# EasyEDA Pro project sincon_badge.eprj, board 1-PCB_PCB_Yuzuki2040
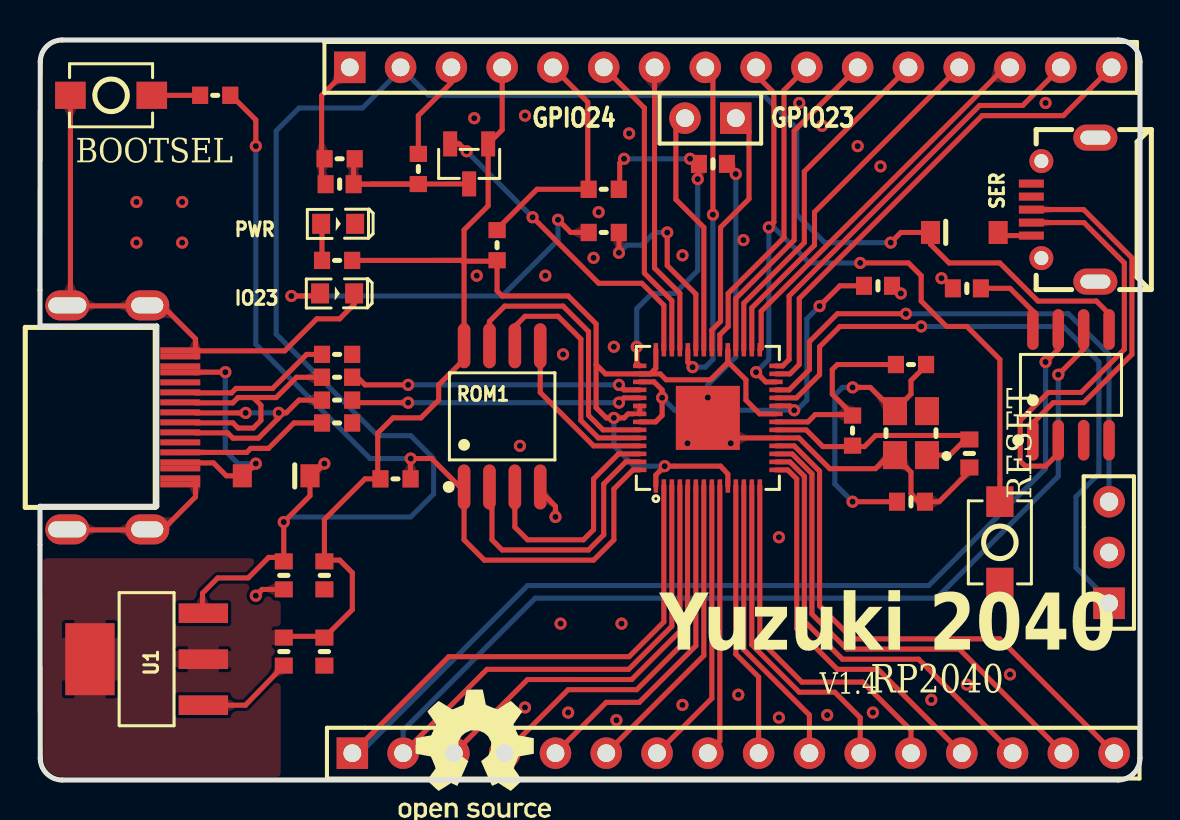
[diagram p2: board, top side]
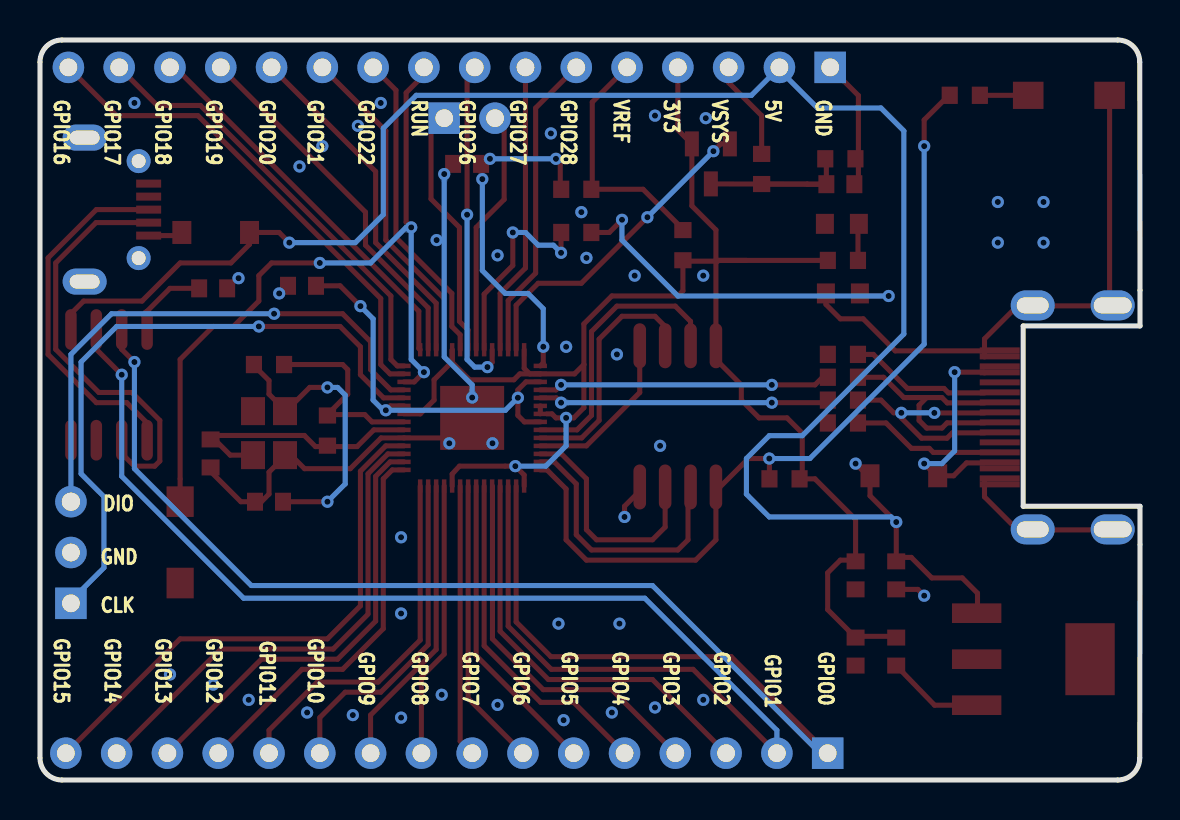
[diagram p3: board, bottom side, seen from below]

Outline 55.01 x 37 mm; copper layers: Top Layer, Bottom Layer. Coordinates in mm from the lower left corner of the outline.
Outline path: 0,24.48 0.01,35.9 arc(0.34,36.68) 1.11,37 53.91,37 arc(54.69,36.68) 55.01,35.9 55.01,1.1 arc(54.69,0.32) 53.91,0 1.11,0 arc(0.34,0.32) 0.01,1.1 0,11.76

## Design rules (mm)
via Default (default): diameter min 0.457, default 0.457, max 100.025; hole min 0.203, default 0.203, max 59.995
pour e88 uses gge9161
pour e585 uses gge15034
pour e587 uses gge15036

## Placement (name value [footprint] x y rotation side)
BOOTSEL  TSA343G00-250J2  [SW-SMD_L4.0-W2.9-LS5.0]  3.56 34.23 0 top
C1  0.1uf  [C0603 NSK]  12.19 6.42 270 top
C2  0.1uf  [C0603 NSK]  12.19 10.23 270 top
C3  0.1u  [C0603 NSK]  33.66 30.81 180 top
C4  0.1u  [C0603 NSK]  14.22 10.23 90 top
C5  2.2u  [C0603 NSK]  14.22 6.42 90 top
C6  1n  [C0603 NSK]  14.99 29.79 0 top
C7  15p  [C0603 NSK]  46.48 16.33 90 top
C8  15p  [C0603 NSK]  43.56 13.91 180 top
C9  0.1u  [C0603 NSK]  41.91 24.71 0 top
C10  10n  [C0603 NSK]  46.36 24.58 180 top
D1  1N4007W  [SOD-123 NSK]  11.81 15.21 180 top
D2  1N4007W  [SOD-123 NSK]  46.23 27.38 0 top
H1  HDR-F-2.54_1x3  [HDR-F-2.54_1X3]  53.47 11.37 90 top
H2  HDR-F-2.54_1x16  [HDR-F-2.54_1X16]  34.67 1.34 0 top
H3  HDR-F-2.54_1x16  [HDR-F-2.54_1X16]  34.54 35.63 0 top
H4  HDR-F-2.54_1x2  [HDR-F-2.54_1X2]  33.53 33.09 180 top
IO23  LED-0603_G  [LED0603_GREEN]  14.86 24.33 0 top
PWR  LED-0603_G  [LED0603_GREEN]  14.91 27.81 0 top
Q2  AO3404  [SOT-23-3_L2.9-W1.3-P1.90-LS2.4-BR]  21.46 30.81 90 top
R1  27  [R0603 NSK]  14.86 18.99 180 top
R2  27  [R0603 NSK]  14.86 20.14 180 top
R3  1K  [R0603 NSK]  14.86 25.98 180 top
R4  DNF（不装）  [R0603 NSK]  17.78 15.06 180 top
R5  1k  [R0603 NSK]  8.76 34.23 0 top
R6  1R  [R0603 NSK]  28.19 29.54 180 top
R7  200R  [R0603 NSK]  22.86 26.74 270 top
R8  470  [R0603 NSK]  28.19 27.38 180 top
R9  200k  [R0603 NSK]  18.92 30.55 90 top
R10  DNF  [R0603 NSK]  40.64 17.47 90 top
R11  100k  [R0603 NSK]  14.99 31.06 0 top
R12  1k  [R0603 NSK]  43.56 20.77 180 top
R13  1k  [R0603 NSK]  14.86 21.28 180 top
R14  1k  [R0603 NSK]  14.86 17.85 180 top
RESET  TSA343G00-250J2  [SW-SMD_L4.0-W2.9-LS5.0]  48.01 11.88 270 top
ROM1  W25Q16JVSSIQ  [SOIC-8_L5.3-W5.3-P1.27-LS8.0-BL]  23.11 18.18 0 top
SER  MICROUSB FEMALE  [MICRO-USB-SMD_5P-P0.65-H-F_C10418]  51.18 28.52 90 top
U1  AMS1117-3.3V  [SOT-223-4_L6.5-W3.5-P2.30-LS7.0-BR]  5.33 6.04 0 top
U2  RP2040  [QFN-56_L7.0-W7.0-P0.90-TL-EP3.2]  33.4 18.11 90 top
U3  CH340N  [SOP-8_L5.0-W4.0-P1.27-LS6.0-BL]  51.56 19.76 0 top
USB1  TYPE-C  [USB-C-SMD_TYC-302-16]  4.19 18.13 270 top
X1  12MHz  [OSC-SMD_4P-L3.2-W2.5-BL-1]  43.56 17.34 90 top

## Footprints (pads in the part's own frame, mm; a bottom-side part is the same pattern mirrored in y, then rotated)
C0603 NSK
  rect 0.8x0.9 smd: 1(-0.7,0) 2(0.7,0)
HDR-F-2.54_1X2
  rect 1.575x1.575 hole 0.889: 1(-1.27,0)
  round 1.575 hole 0.889: 2(1.27,0)
HDR-F-2.54_1X3
  rect 1.575x1.575 hole 0.889: 1(-2.54,0)
  round 1.575 hole 0.889: 2(0,0)
  round 1.575 hole 0.914: 3(2.54,0)
HDR-F-2.54_1X16
  rect 1.575x1.575 hole 0.889: 1(-19.05,0)
  round 1.575 hole 0.889: 2(-16.51,0) 3(-13.97,0) 4(-11.43,0) 5(-8.89,0) 6(-6.35,0) 7(-3.81,0) 8(-1.27,0) 9(1.27,0) 10(3.81,0) 11(6.35,0) 12(8.89,0) 13(11.43,0) 14(13.97,0) 15(16.51,0) 16(19.05,0)
LED0603_GREEN
  rect 0.9x1 smd: 1(-0.85,0) 2(0.85,0)
MICRO-USB-SMD_5P-P0.65-H-F_C10418
  oval 1.3x2.2 hole 0.7x1.5: 0(-3.6,-1.6) 0(3.6,-1.6)
  round 1.2 hole 0.7: 0(-2.425,1.1) 0(2.425,1.1)
  rect 0.4x1.25 smd: 1(-1.3,1.6) 2(-0.65,1.6) 3(0,1.6) 4(0.65,1.6) 5(1.3,1.6)
OSC-SMD_4P-L3.2-W2.5-BL-1
  rect 1.4x1.2 smd: 1(-1.1,-0.8) 2(1.1,-0.8) 3(1.1,0.8) 4(-1.1,0.8)
QFN-56_L7.0-W7.0-P0.90-TL-EP3.2
  rect 0.665x0.224 smd: 1(-3.408,2.6) 2(-3.408,2.2) 3(-3.408,1.8) 4(-3.408,1.4) 5(-3.408,1) 6(-3.408,0.6) 7(-3.408,0.2) 8(-3.408,-0.2) 9(-3.408,-0.6) 10(-3.408,-1) 11(-3.408,-1.4) 12(-3.408,-1.8) 13(-3.408,-2.2) 14(-3.408,-2.6) 29(3.408,-2.6) 30(3.408,-2.2) 31(3.408,-1.8) 32(3.408,-1.4) 33(3.408,-1) 34(3.408,-0.6) 35(3.408,-0.2) 36(3.408,0.2) 37(3.408,0.6) 38(3.408,1) 39(3.408,1.4) 40(3.408,1.8) 41(3.408,2.2) 42(3.408,2.6)
  rect 0.224x0.665 smd: 15(-2.6,-3.408) 16(-2.2,-3.408) 17(-1.8,-3.408) 18(-1.4,-3.408) 19(-1,-3.408) 20(-0.6,-3.408) 21(-0.2,-3.408) 22(0.2,-3.408) 23(0.6,-3.408) 24(1,-3.408) 25(1.4,-3.408) 26(1.8,-3.408) 27(2.2,-3.408) 28(2.6,-3.408) 43(2.6,3.408) 44(2.2,3.408) 45(1.8,3.408) 46(1.4,3.408) 47(1,3.408) 48(0.6,3.408) 49(0.2,3.408) 50(-0.2,3.408) 51(-0.6,3.408) 52(-1,3.408) 53(-1.4,3.408) 54(-1.8,3.408) 55(-2.2,3.408) 56(-2.6,3.408)
  rect 3.2x3.2 smd: 57(0,0)
R0603 NSK
  rect 0.806x0.864 smd: 1(-0.753,0) 2(0.753,0)
SOD-123 NSK
  rect 0.95x1.15 smd: 1(-1.692,0) 2(1.692,0)
SOIC-8_L5.3-W5.3-P1.27-LS8.0-BL
  oval 0.63x2.25 smd: 1(-1.905,-3.53) 2(-0.635,-3.53) 3(0.635,-3.53) 4(1.905,-3.53) 5(1.905,3.53) 6(0.635,3.53) 7(-0.635,3.53) 8(-1.905,3.53)
SOP-8_L5.0-W4.0-P1.27-LS6.0-BL
  oval 0.574x2.035 smd: 1(-1.905,-2.768) 2(-0.635,-2.768) 3(0.635,-2.768) 4(1.905,-2.768) 5(1.905,2.768) 6(0.635,2.768) 7(-0.635,2.768) 8(-1.905,2.768)
SOT-23-3_L2.9-W1.3-P1.90-LS2.4-BR
  rect 1.25x0.7 smd: 1(1,-0.95) 2(1,0.95) 3(-1,0)
SOT-223-4_L6.5-W3.5-P2.30-LS7.0-BR
  rect 2.47x0.98 smd: 1(2.835,-2.3) 2(2.835,0) 3(2.835,2.3)
  rect 2.47x3.6 smd: 4(-2.835,0)
SW-SMD_L4.0-W2.9-LS5.0
  rect 1.53x1.36 smd: 1(-2.035,0) 2(2.035,0)
USB-C-SMD_TYC-302-16
  oval 1.5x2.2 hole 0.8x1.6: 1(-5.6,1.175) 2(5.6,1.175)
  oval 1.5x2.2 hole 0.8x1.9: 3(-5.6,-2.825) 4(5.6,-2.825)
  rect 0.3x2 smd: A1(-3.35,2.825) A4(-2.55,2.825) A5(-1.25,2.825) A6(-0.25,2.825) A7(0.25,2.825) A8(-1.75,2.825) A9(2.55,2.825) A12(3.35,2.825) B1(3.05,2.825) B4(2.25,2.825) B5(1.75,2.825) B6(0.75,2.825) B7(-0.75,2.825) B8(1.25,2.825) B9(-2.25,2.825) B12(-3.05,2.825)

## Nets
As in the schematic, except:
GND: BOOTSEL.1 C1.2 C2.2 C3.1 C4.1 C5.1 C6.1 C7.1 C8.1 C9.2 C10.2 H1.2 H3.1 IO23.2 PWR.2 R11.1 R13.1 R14.1 RESET.2 ROM1.4 SER.0 SER.5 U1.1 U2.19 U2.57 U3.3 USB1.1 USB1.2 USB1.3 USB1.4 USB1.A1 USB1.A12 USB1.B1 USB1.B12 X1.2 X1.4
D2_2: D2.2 SER.1
SD+: SER.3 U3.1
SD-: SER.2 U3.2

Pads without a net: SER 4; U3 4; USB1 A8 B8

## Via types
v1: diameter 0.61, hole 0.305, Top Layer to Bottom Layer, 84 vias

## Routing (per net, layer and track width the routed paths; a pad name or vN(x,y) marks a point on that pad's centre or on a via; arc(x,y) is an arc through that point)
1V1: length 19.9
  Top Layer w0.254: 41.01,24.71 40,24.71 v1(38.99,23.69) ; U2.50 30.79,17.91 31.12,18.23 31.12,19.5 30.71,19.91 U2.45 ; 37.72,18.49 37.5,18.71 36.81,18.71
  Bottom Layer w0.254: 31.11,19.11 31.74,18.49 37.85,18.49 38.35,18.99 38.35,23.06 v1(38.99,23.69)
  vias: v1(31.11,19.11) v1(37.72,18.49)
3V3: length 83.7
  Top Layer w0.254: 36.81,18.31 35.99,18.31 35.31,18.99 35.31,20.01 34.4,20.91 34.4,21.51 34.4,20.88 33.53,20.01 31.32,20.01 31.02,20.31 U2.44 ; 29.66,18.31 29.41,18.31 29.21,18.11 v1(28.7,18.11) 28.32,18.11 27.81,18.61 27.81,20.77 ; U2.44 30.52,20.31 30.8,20.58 30.8,21.51 ; U2.44 28.28,20.31 27.81,20.77 ; 19.69,25.98 21.08,25.98 21.12,25.94 22.86,25.94 22.86,24.46 23.11,24.2 26.42,24.2 27.81,22.8 27.81,20.77 ; 19.69,25.98 21.21,25.98 ; 19.69,25.98 15.66,25.98 ; U2.1 30.8,15.25 v1(31.24,15.69) 34.04,15.69 34.4,15.3 U2.10 ; C5.2 15.62,8.52 15.62,10.36 14.99,10.99 14.22,10.99 14.22,13.03 16.26,15.06 17.03,15.06 16.89,15.19 16.89,17.34 17.65,18.11 19.05,18.11 19.94,18.99 19.94,19.76 21.21,21.03 21.21,25.98 ; 21.21,25.98 21.21,27.5 22.41,28.71 Q2.1 23.11,32.51 H3.4 ; 2.54,6.04 U1.4 ; U2.48 U2.49 ; 12.19,7.18 14.22,7.18
  Bottom Layer w0.254: v1(31.24,15.69) 29.72,15.69 28.7,16.71 v1(28.7,18.11)
GND: length 77
  Top Layer w0.254: 36.81,17.1 37.96,17.1 39.5,15.57 41.78,15.57 42.46,16.24 42.71,16.24 43.56,15.39 43.56,14.3 43.94,13.91 44.97,13.91 46.48,15.43 ; C1.2 10.27,3.74 U1.1 ; 34.36,30.81 34.8,30.36 v1(34.8,30.3) ; 2.13,12.51 6.13,12.51 7.78,14.16 7.78,15.06 ; BOOTSEL.1 1.52,23.71 6.13,23.71 7.78,22.06 7.78,21.16 ; 7.78,21.46 12.24,21.46 13.84,23.06 14.99,23.06 15.71,23.78 15.71,24.2 ; v1(34.54,16.84) 34.81,17.1 U2.19 ; 10.8,9.22 11.11,9.53 12.19,9.53 ; 14.08,29.79 14.08,34.22 H3.1 ; 25.02,14.45 25.78,13.69 25.78,13.15
  Bottom Layer w0.254: v1(34.8,30.3) 34.8,21.15 33.4,19.76 v1(33.4,19.12)
  vias: v1(4.83,28.9) v1(4.83,26.87) v1(7.11,28.9) v1(7.11,26.87) v1(10.79,9.22) v1(21.72,33.09) v1(21.84,25.22) v1(21.84,4.01) v1(24,16.71) v1(24.26,33.22) v1(24.26,3.63) v1(25.27,25.22) v1(25.78,13.15) v1(26.03,7.82) v1(26.16,21.28) v1(26.42,3.37) v1(27.69,26.11) v1(27.94,28.39) v1(28.7,21.66) v1(28.83,2.99) v1(29.08,7.82) v1(29.46,32.33) v1(32.13,26.23) v1(32.13,3.75) v1(32.39,16.84) v1(34.92,4.26) v1(35.18,27) v1(36.96,12.14) v1(36.96,8.33) v1(36.96,3.12) v1(37.97,33.85) v1(39.12,32.71) v1(39.37,3.25) v1(40.89,31.69) v1(41.66,3.37) v1(42.04,30.68) v1(43.05,24.33) v1(44.58,4.01) v1(45.09,25.09) v1(46.35,4.77) v1(48.51,5.28) v1(50.29,33.85)
VBUS: length 94.1
  Top Layer w0.254: U3.5 53.47,23.31 52.83,23.95 49.91,23.95 48.01,25.85 45.47,25.85 44.54,26.78 44.54,27.38 43.05,27.38 v1(42.55,26.87) ; U1.3 8.13,8.38 8.13,9.34 8.89,10.1 10.41,10.1 11.44,11.13 12.19,11.13 12.19,12.9 13.5,14.21 D1.1 13.61,15.21 v1(14.22,15.82)
  Bottom Layer w0.254: v1(42.55,26.87) 39.24,26.87 37.85,28.27 37.85,32.58 36.19,34.23 19.43,34.23 H3.2 18.03,35.5 16.13,33.6 12.95,33.6 11.81,32.46 11.81,22.3 16.89,17.22 18.54,17.22 19.69,16.07 19.69,14.3 18.54,13.15 12.45,13.15 12.19,12.9
  vias: v1(12.19,12.9)
ADC_AVDD: length 17.6
  Top Layer w0.254: 28.99,29.54 28.99,30.84 v1(29.21,31.06) ; v1(32.89,30.04) 32.95,30.1 32.95,30.81 32.77,30.81 v1(32.51,31.06) ; 29.99,20.7 29.84,20.85 v1(29.84,21.66)
  Bottom Layer w0.254: v1(32.89,30.04) 32.89,25.47 31.75,24.33 30.61,24.33 29.84,23.57 v1(29.84,21.66) ; v1(32.51,31.06) v1(29.21,31.06)
ADC_VREF: length 12.2
  Top Layer w0.254: 22.86,27.54 24.85,29.54 27.39,29.54 27.39,33.89 H3.5
BOOTSEL_2: length 2.4
  Top Layer w0.254: 7.96,34.23 BOOTSEL.2
CC1: length 7.1
  Top Layer w0.254: R13.2 13.34,21.28 11.63,19.58 9.8,19.58 9.58,19.36 7.78,19.36
CC2: length 7.7
  Top Layer w0.254: USB1.B5 10.34,16.38 10.54,16.58 11.43,16.58 12.7,17.85 R14.2
D2_2: length 1.7
  Top Layer w0.254: 47.92,27.38 48.08,27.22 SER.1
GPIO0: length 72.9
  Top Layer w0.254: H2.1 20.45,6.17 29.46,6.17 31.2,7.91 U2.2 ; v1(50.29,20.9) 50.93,21.53 U3.7
  Bottom Layer w0.254: v1(50.29,20.9) 50.29,15.57 44.44,9.72 24.38,9.72 16,1.34 H2.1
GPIO1: length 70
  Top Layer w0.254: v1(50.93,20.26) 52.2,21.53 U3.6 ; U2.3 31.6,7.69 29.44,5.53 22.35,5.53 H2.2
  Bottom Layer w0.254: 18.16,1.47 18.16,2.48 24.77,9.09 44.83,9.09 50.93,15.18 v1(50.93,20.26)
GPIO2: length 21.1
  Top Layer w0.254: 32,14.7 32,7.44 29.59,5.02 24.38,5.02 H2.3
GPIO3: length 19.2
  Top Layer w0.254: 32.39,14.7 32.39,7.06 29.84,4.52 26.42,4.52 H2.4
GPIO4: length 17.2
  Top Layer w0.254: H2.5 28.32,3.88 29.97,3.88 32.8,6.71 U2.6
GPIO5: length 15.4
  Top Layer w0.254: U2.7 33.2,6.22 H2.6
GPIO6: length 14.5
  Top Layer w0.254: U2.8 33.6,4.08 H2.7
GPIO7: length 13.6
  Top Layer w0.254: H2.8 34,1.94 U2.9
GPIO8: length 13.8
  Top Layer w0.254: U2.11 34.8,6.29 35.94,5.15 H2.9
GPIO9: length 14.7
  Top Layer w0.254: 35.2,14.7 35.2,6.53 38.48,3.25 H2.10
GPIO10: length 16.6
  Top Layer w0.254: U2.13 35.6,6.76 37.97,4.39 39.75,4.39 41.02,3.12 H2.11
GPIO11: length 18.3
  Top Layer w0.254: 36,14.7 36,7 38.1,4.9 41.15,4.9 43.56,2.48 H2.12
GPIO12: length 19.5
  Top Layer w0.254: 36.81,15.5 37.4,15.5 37.85,15.06 37.85,7.56 39.88,5.53 41.91,5.53 H2.13
GPIO13: length 22.1
  Top Layer w0.254: H2.14 43.94,6.04 40.13,6.04 38.23,7.95 38.23,15.18 37.51,15.91 36.81,15.91
GPIO14: length 24.6
  Top Layer w0.254: U2.17 37.62,16.3 38.61,15.31 38.61,8.33 ; H2.15 45.97,6.55 40.35,6.55 38.61,8.29
GPIO15: length 27.2
  Top Layer w0.254: H2.16 48.01,7.06 40.64,7.06 38.99,8.71 38.99,15.44 37.72,16.71 36.81,16.71
GPIO16: length 25.1
  Top Layer w0.254: H3.16 51.18,33.22 47.12,33.22 37.97,24.07 37.97,20.77 37.51,20.31 36.81,20.31
GPIO17: length 22.3
  Top Layer w0.254: H3.15 49.15,33.73 46.99,33.73 37.47,24.2 37.47,21.03 37.14,20.7 36.81,20.7
GPIO18: length 19.5
  Top Layer w0.254: 36,21.51 36.07,21.58 36.07,23.44 48.26,35.63 H3.14
GPIO19: length 18.4
  Top Layer w0.254: 35.6,21.51 35.6,23.61 38.74,26.74 38.74,28.39 H3.13
GPIO20: length 17.5
  Top Layer w0.254: 35.2,21.51 35.2,23.84 38.23,26.87 38.23,30.42 H3.12
GPIO21: length 16.6
  Top Layer w0.254: H3.11 37.72,32.46 37.72,27 34.8,24.08 34.8,21.51
GPIO22: length 15.9
  Top Layer w0.254: H3.10 37.21,34.49 37.21,27.12 34.42,24.33 34.42,22.68 34,22.26 34,21.51
GPIO23: length 12.6
  Top Layer w0.254: U2.35 33.6,22.5 34.04,22.93 34.04,27.63 35.46,29.05 35.46,32.43 34.8,33.09
GPIO24: length 12.3
  Top Layer w0.254: H4.2 31.8,32.63 31.8,29.03 33.2,27.63 U2.36
GPIO25: length 10.3
  Top Layer w0.254: 28.99,27.38 28.96,27.34 28.96,26.36 ; 31.37,27.38 31.37,25.73 32.8,24.29 U2.37
  Bottom Layer w0.254: v1(28.96,26.36) 29.34,26.74 30.1,26.74 30.73,27.38 v1(31.37,27.38)
GPIO26_ADC0: length 16.9
  Top Layer w0.254: 32.64,20.65 32.4,20.88 32.4,21.51 ; H3.8 33.66,35.25 v1(33.66,28.27)
  Bottom Layer w0.254: 32.64,20.65 33.27,20.65 33.66,21.03 v1(33.66,28.27)
  vias: v1(32.64,20.65)
GPIO27_ADC1: length 14.6
  Top Layer w0.254: H3.7 30.73,25.6 32,24.33 U2.39
GPIO28_ADC2: length 15.5
  Top Layer w0.254: U2.40 31.6,23.97 30.23,25.34 30.23,33.6 H3.6
GPIO29_ADC3: length 16.3
  Top Layer w0.254: 21.34,31.44 20.97,31.81 Q2.2 ; v1(24.64,28.14) 27.94,24.84 30.1,24.84 31.2,23.73 31.2,21.51
  Bottom Layer w0.254: v1(21.34,31.44) v1(24.64,28.14)
PWR_1: length 1.8
  Top Layer w0.254: R3.2 14.1,27.76 14.06,27.81
Q2_3: length 9.9
  Top Layer w0.254: R9.1 16.64,29.8 16.64,29.79 15.89,29.79 Q2.3 ; 15.69,29.79 15.69,31.01 15.74,31.06
QSPI_SCLK: length 12.5
  Top Layer w0.254: 23.75,21.51 23.75,22.68 24.26,23.19 25.91,23.19 27.05,22.04 27.05,17.98 27.92,17.1 U2.52
QSPI_SD0: length 8.2
  Top Layer w0.254: U2.53 27.69,16.71 25.02,19.38 25.02,21.51
QSPI_SD1: length 13.4
  Top Layer w0.254: 22.48,14.45 22.61,14.32 22.61,12.01 23.11,11.5 27.43,11.5 28.19,12.26 28.19,14.8 29.29,15.91 U2.55
QSPI_SD2: length 11.6
  Top Layer w0.254: U2.54 28.93,16.3 27.69,15.06 27.69,12.52 27.18,12.01 24.38,12.01 23.75,12.64 23.75,14.45
QSPI_SD3: length 14.3
  Top Layer w0.254: 22.48,21.51 22.48,22.93 23.24,23.69 26.16,23.69 27.43,22.42 27.43,18.23 28.16,17.51 U2.51
QSPI_SS: length 42.4
  Top Layer w0.254: 9.56,34.23 10.8,33 10.8,31.69 ; 18.53,15.06 18.53,16.07 v1(18.54,16.07) 19.58,16.07 21.21,14.45 21.21,12.01 22.22,10.99 27.69,10.99 28.7,12.01 28.7,14.55 29.66,15.5 U2.56
  Bottom Layer w0.254: v1(18.54,16.07) 16.51,16.07 10.8,21.79 10.8,31.69
  vias: v1(10.79,31.69)
R8_2: length 18.7
  Top Layer w0.254: 25.91,28.01 26.54,27.38 27.39,27.38 ; v1(12.57,24.2) 14.01,24.2
  Bottom Layer w0.254: v1(25.91,28.01) 25.91,27 23.11,24.2 v1(12.57,24.2)
RUN: length 39.3
  Top Layer w0.254: v1(36.45,27.63) 36.7,27.88 36.7,34.36 35.81,35.25 H3.9 ; RESET.1 48.01,21.03 46.36,22.68 45.34,22.68 44.07,23.95 44.07,25.22 43.43,25.85 v1(41.02,25.85) ; 36.81,19.9 36.3,19.9 v1(35.81,20.39)
  Bottom Layer w0.254: v1(35.81,20.39) 36.45,21.03 v1(36.45,27.63) 36.7,27.63 38.48,25.85 v1(41.02,25.85)
SD+: length 18.1
  Top Layer w0.254: SER.3 52.2,28.52 54.61,26.11 54.61,21.28 52.2,18.87 50.67,18.87 49.66,17.85 49.66,16.99
SD-: length 21.4
  Top Layer w0.254: 50.93,16.99 50.93,16.33 50.29,15.69 49.28,15.69 49.02,15.95 49.02,17.98 50.42,19.38 52.07,19.38 54.23,21.53 54.23,25.85 52.21,27.87 SER.2
SWCLK: length 32.4
  Top Layer w0.254: U2.24 37.83,19.11 38.99,20.26 38.99,21.66 40,22.68 v1(44.07,22.68)
  Bottom Layer w0.254: v1(44.07,22.68) 51.18,22.68 52.96,20.9 52.96,15.31 51.82,14.17 51.82,10.61 53.47,8.96 H1.1
SWDIO: length 27.3
  Top Layer w0.254: v1(43.31,23.31) 39.88,23.31 38.48,21.92 38.48,20.52 37.47,19.51 U2.25
  Bottom Layer w0.254: 53.47,13.91 53.47,21.28 51.44,23.31 v1(43.31,23.31)
U2_46: length 14.6
  Top Layer w0.254: 18.42,19.76 16.26,19.76 15.88,20.14 R2.1 ; U2.46 29.21,19.51 28.96,19.76
  Bottom Layer w0.254: v1(28.96,19.76) 18.41,19.76
  vias: v1(18.41,19.76)
U2_47: length 14.5
  Top Layer w0.254: 15.66,18.99 15.79,18.87 18.42,18.87 ; U2.47 29.19,19.11 28.96,18.87
  Bottom Layer w0.254: v1(28.96,18.87) 18.41,18.87
  vias: v1(18.41,18.87)
U3_8: length 4
  Top Layer w0.254: U3.8 49.66,23.44 48.51,24.58 47.06,24.58
USB_D+: length 11.5
  Top Layer w0.254: 7.78,18.35 10.29,18.35 ; 14.06,18.99 12.95,18.99 12.32,18.36 v1(11.94,18.36) 11.94,18.11 10.92,17.09 9.65,17.09 9.39,17.36 7.78,17.36
  Bottom Layer w0.254: v1(11.94,18.36) 10.29,18.36 10.29,18.36
  vias: v1(10.29,18.36)
USB_D-: length 11.7
  Top Layer w0.254: 10.67,19.12 11.05,18.74 11.05,17.98 10.67,17.6 9.91,17.6 9.65,17.86 7.78,17.86 ; 10.67,19.12 9.91,19.12 9.64,18.86 7.78,18.86 ; 10.67,19.12 11.81,19.12 12.83,20.14 R2.2
VSYS: length 5
  Top Layer w0.254: H3.3 20.57,34.87 18.92,33.22 R9.2
VUSBC: length 10.8
  Top Layer w0.254: 7.78,20.36 7.81,20.39 v1(9.27,20.39) ; v1(10.8,15.82) 10.19,15.21 D1.2 9.32,15.21 8.68,15.86 7.78,15.86
  Bottom Layer w0.254: v1(10.8,15.82) 9.91,15.82 9.27,16.45 v1(9.27,20.39)
X1_3: length 14.3
  Top Layer w0.254: 44.36,20.77 43.56,19.97 43.56,19.29 42.71,18.44 41.52,19.63 40.64,19.63 ; 42.66,13.91 40.64,13.91
  Bottom Layer w0.254: v1(40.64,13.91) 39.75,14.8 39.75,19.25 40.13,19.63 v1(40.64,19.63)
XIN: length 12.7
  Top Layer w0.254: 44.41,16.24 45.5,16.24 46.48,17.23 41.79,17.23 41.24,16.67 39.15,16.67 38.32,17.51 36.81,17.51
XOUT: length 9.9
  Top Layer w0.254: 36.81,17.91 38.41,17.91 38.77,18.27 40.64,18.27 39.62,19.29 39.62,20.52 39.88,20.77 42.76,20.77

## Copper pours and planes (outline as drawn; the poured copper is in the pictures)
3V3 on Top Layer: -0.76,10.99 -0.76,-0.44 -0.13,-1.07 12.32,-1.07 11.94,-0.69 11.94,10.99
GND on Top Layer: -3.05,38.93 -3.05,10.87 11.94,10.87 11.94,-0.69 12.32,-1.07 57.91,-1.07 57.91,38.81
GND on Bottom Layer: -2.67,39.19 -2.67,-3.74 -0.89,-5.52 60.58,-5.52 60.83,-5.26 60.83,36.77 58.42,39.19

Small or netless copper shapes (teardrops, artwork), in the pictures only: 98 on Top Layer, 4 on Bottom Layer

## Text on the board
Bottom Silkscreen Layer: GPIO0 | GND | 5V | GPIO1 | GPIO2 | VSYS | 3V3 | GPIO3 | VREF | GPIO4 | GPIO5 | GPIO28 | GPIO6 | GPIO27 | GPIO7 | GPIO26 | GPIO8 | RUN | GPIO9 | GPIO22 | GPIO10 | GPIO21 | GPIO11 | GPIO20 | GPIO12 | GPIO19 | GPIO13 | GPIO18 | GPIO14 | GPIO17 | GPIO16 | GPIO15 | DIO | CLK
Top Silkscreen Layer: GPIO24 | GPIO23 | Yuzuki 2040 | V1.4 | RP2040
